# EAGLE design romscraj-printbed2 (EAGLE 5.10)
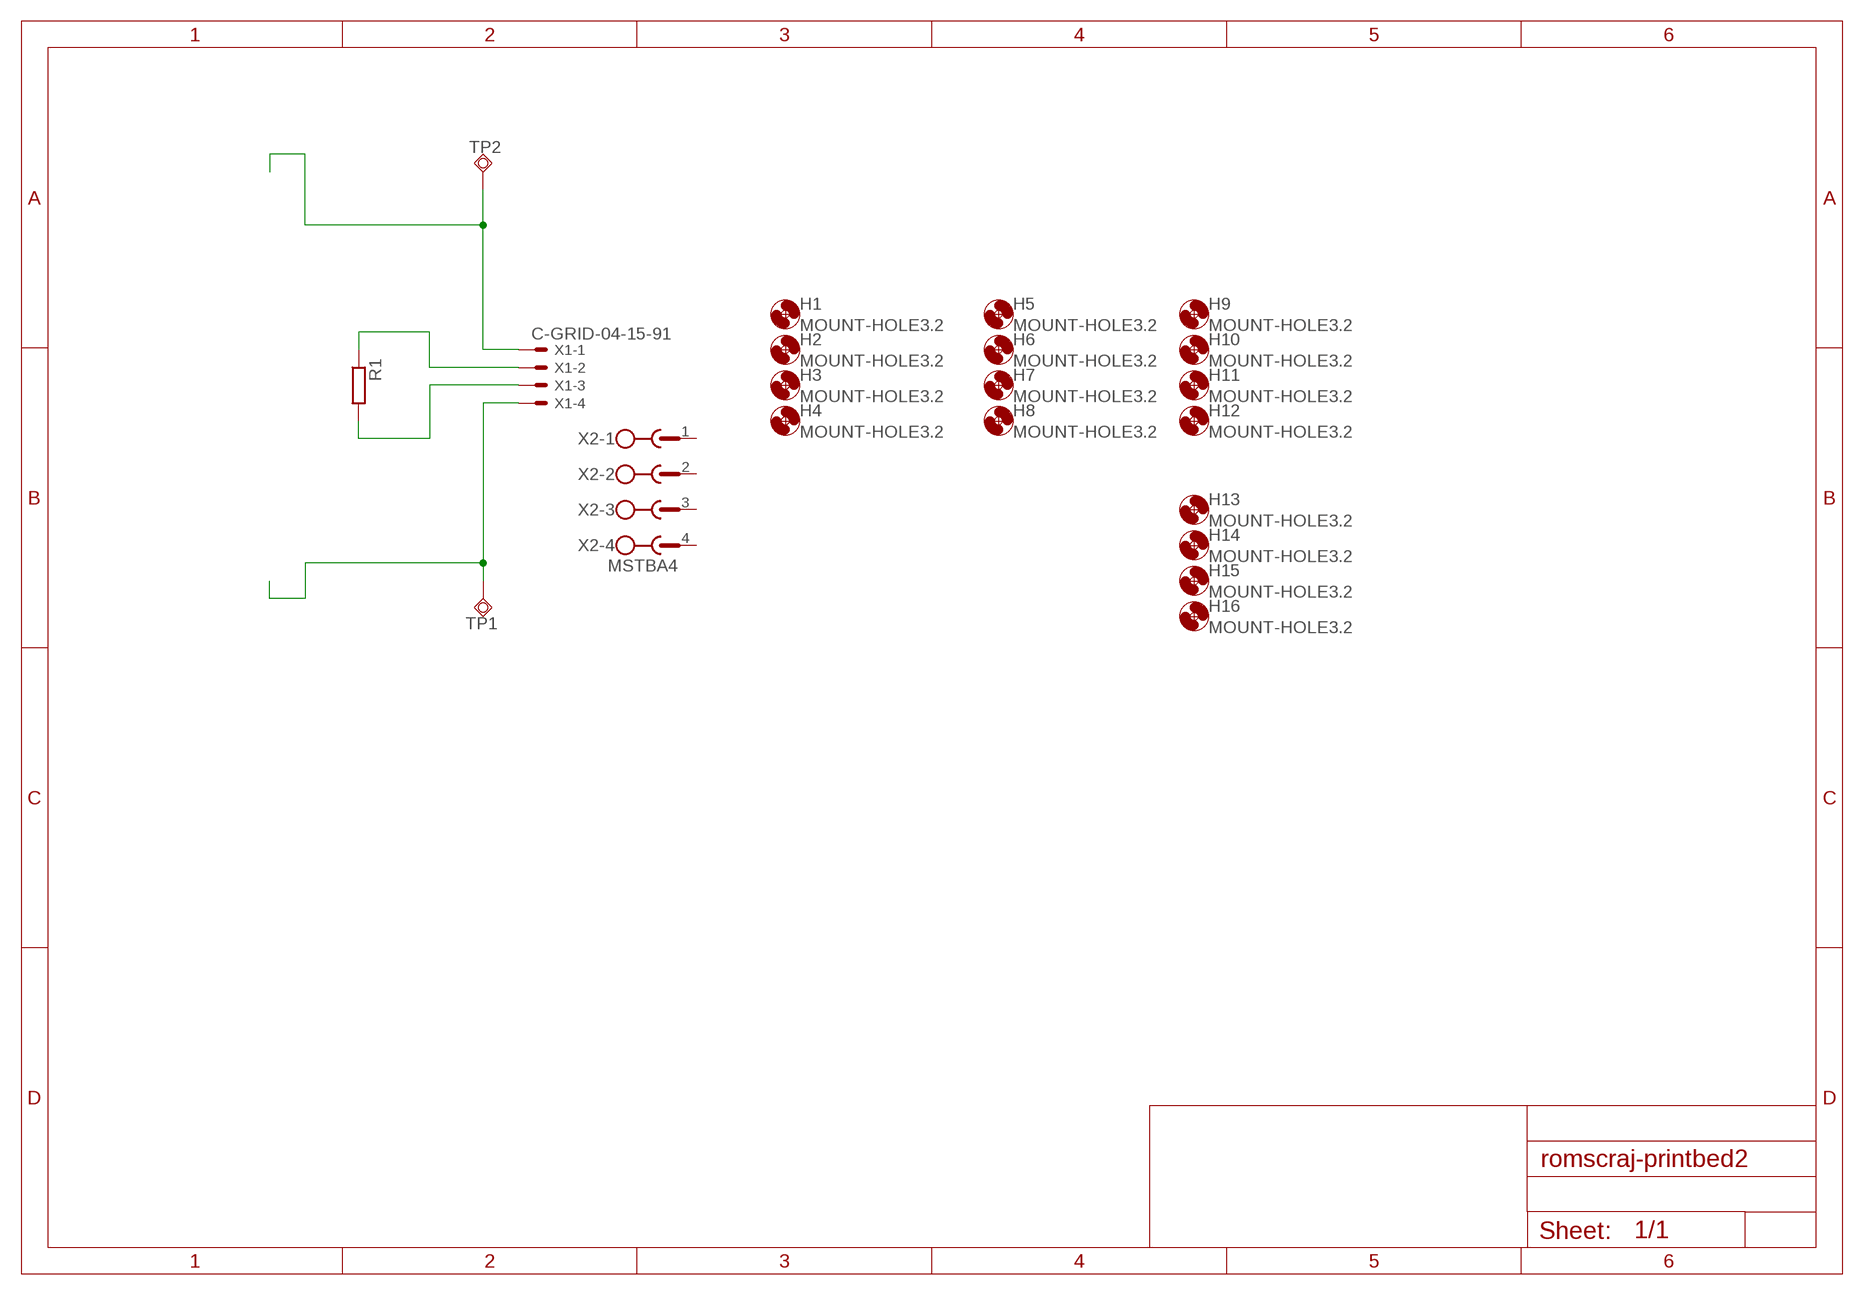
[diagram p0: schematic, sheet 1]

## Parts
H1  MOUNT-HOLE3.2  [3,2]
H2  MOUNT-HOLE3.2  [3,2]
H3  MOUNT-HOLE3.2  [3,2]
H4  MOUNT-HOLE3.2  [3,2]
H5  MOUNT-HOLE3.2  [3,2]
H6  MOUNT-HOLE3.2  [3,2]
H7  MOUNT-HOLE3.2  [3,2]
H8  MOUNT-HOLE3.2  [3,2]
H9  MOUNT-HOLE3.2  [3,2]
H10  MOUNT-HOLE3.2  [3,2]
H11  MOUNT-HOLE3.2  [3,2]
H12  MOUNT-HOLE3.2  [3,2]
H13  MOUNT-HOLE3.2  [3,2]
H14  MOUNT-HOLE3.2  [3,2]
H15  MOUNT-HOLE3.2  [3,2]
H16  MOUNT-HOLE3.2  [3,2]
R1  R-EU_R2010  [R2010]
TP1  TPSQTP20SQ  [TP20SQ]
TP2  TPSQTP20SQ  [TP20SQ]
X1  C-GRID-04-15-91  [15-91-04]
X2  MSTBA4  [MSTBA4]

## Nets
N$1: TP2.TP X1.1
N$2: TP1.TP X1.4
N$3: R1.1 X1.2
N$4: R1.2 X1.3
Unconnected: X2.1 X2.2 X2.3 X2.4

## Library data of the parts
H1-H16 = holes:MOUNT-HOLE: MOUNTING HOLE with drill center marker
R1 = rcl:R-EU_: RESISTOR, European symbol
TP1 TP2 = testpad:TPSQ: Test pad
X1 = con-molex:C-GRID-04: CONNECTOR wire to board 2.54 mm (0.100") pitch header
X2 = con-phoenix-508:MSTBA4: PHOENIX

## Board
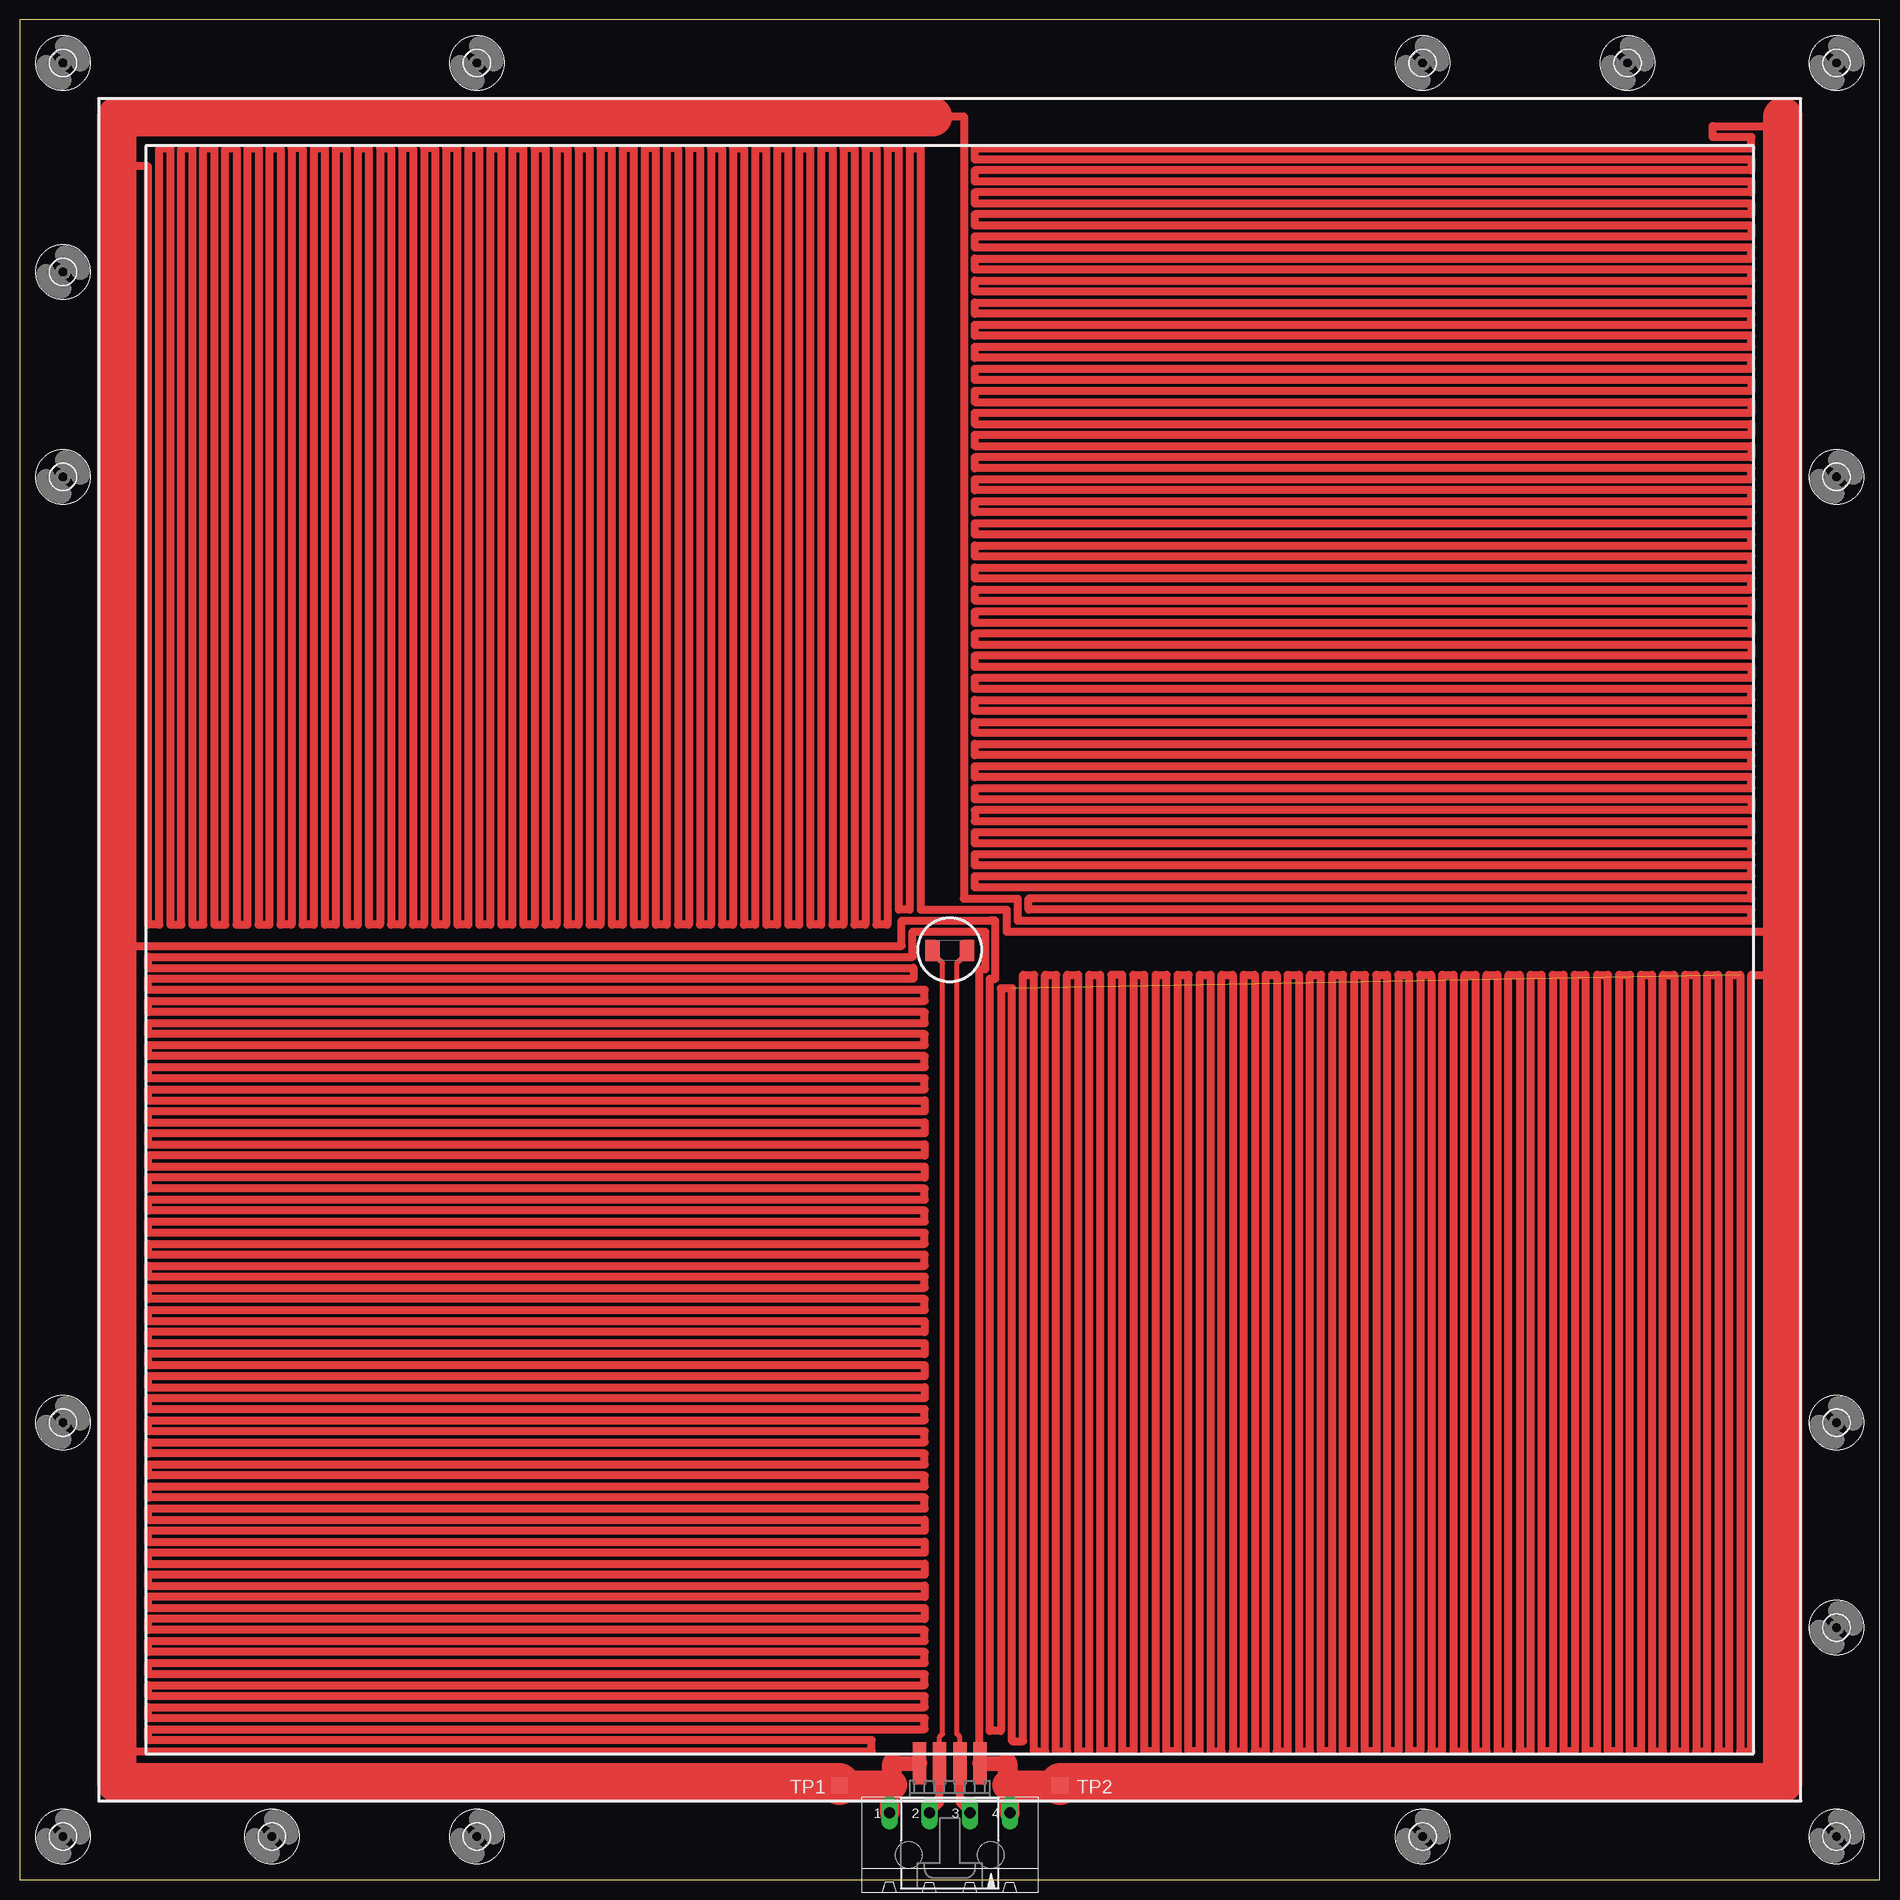
[diagram p1: board, top side]
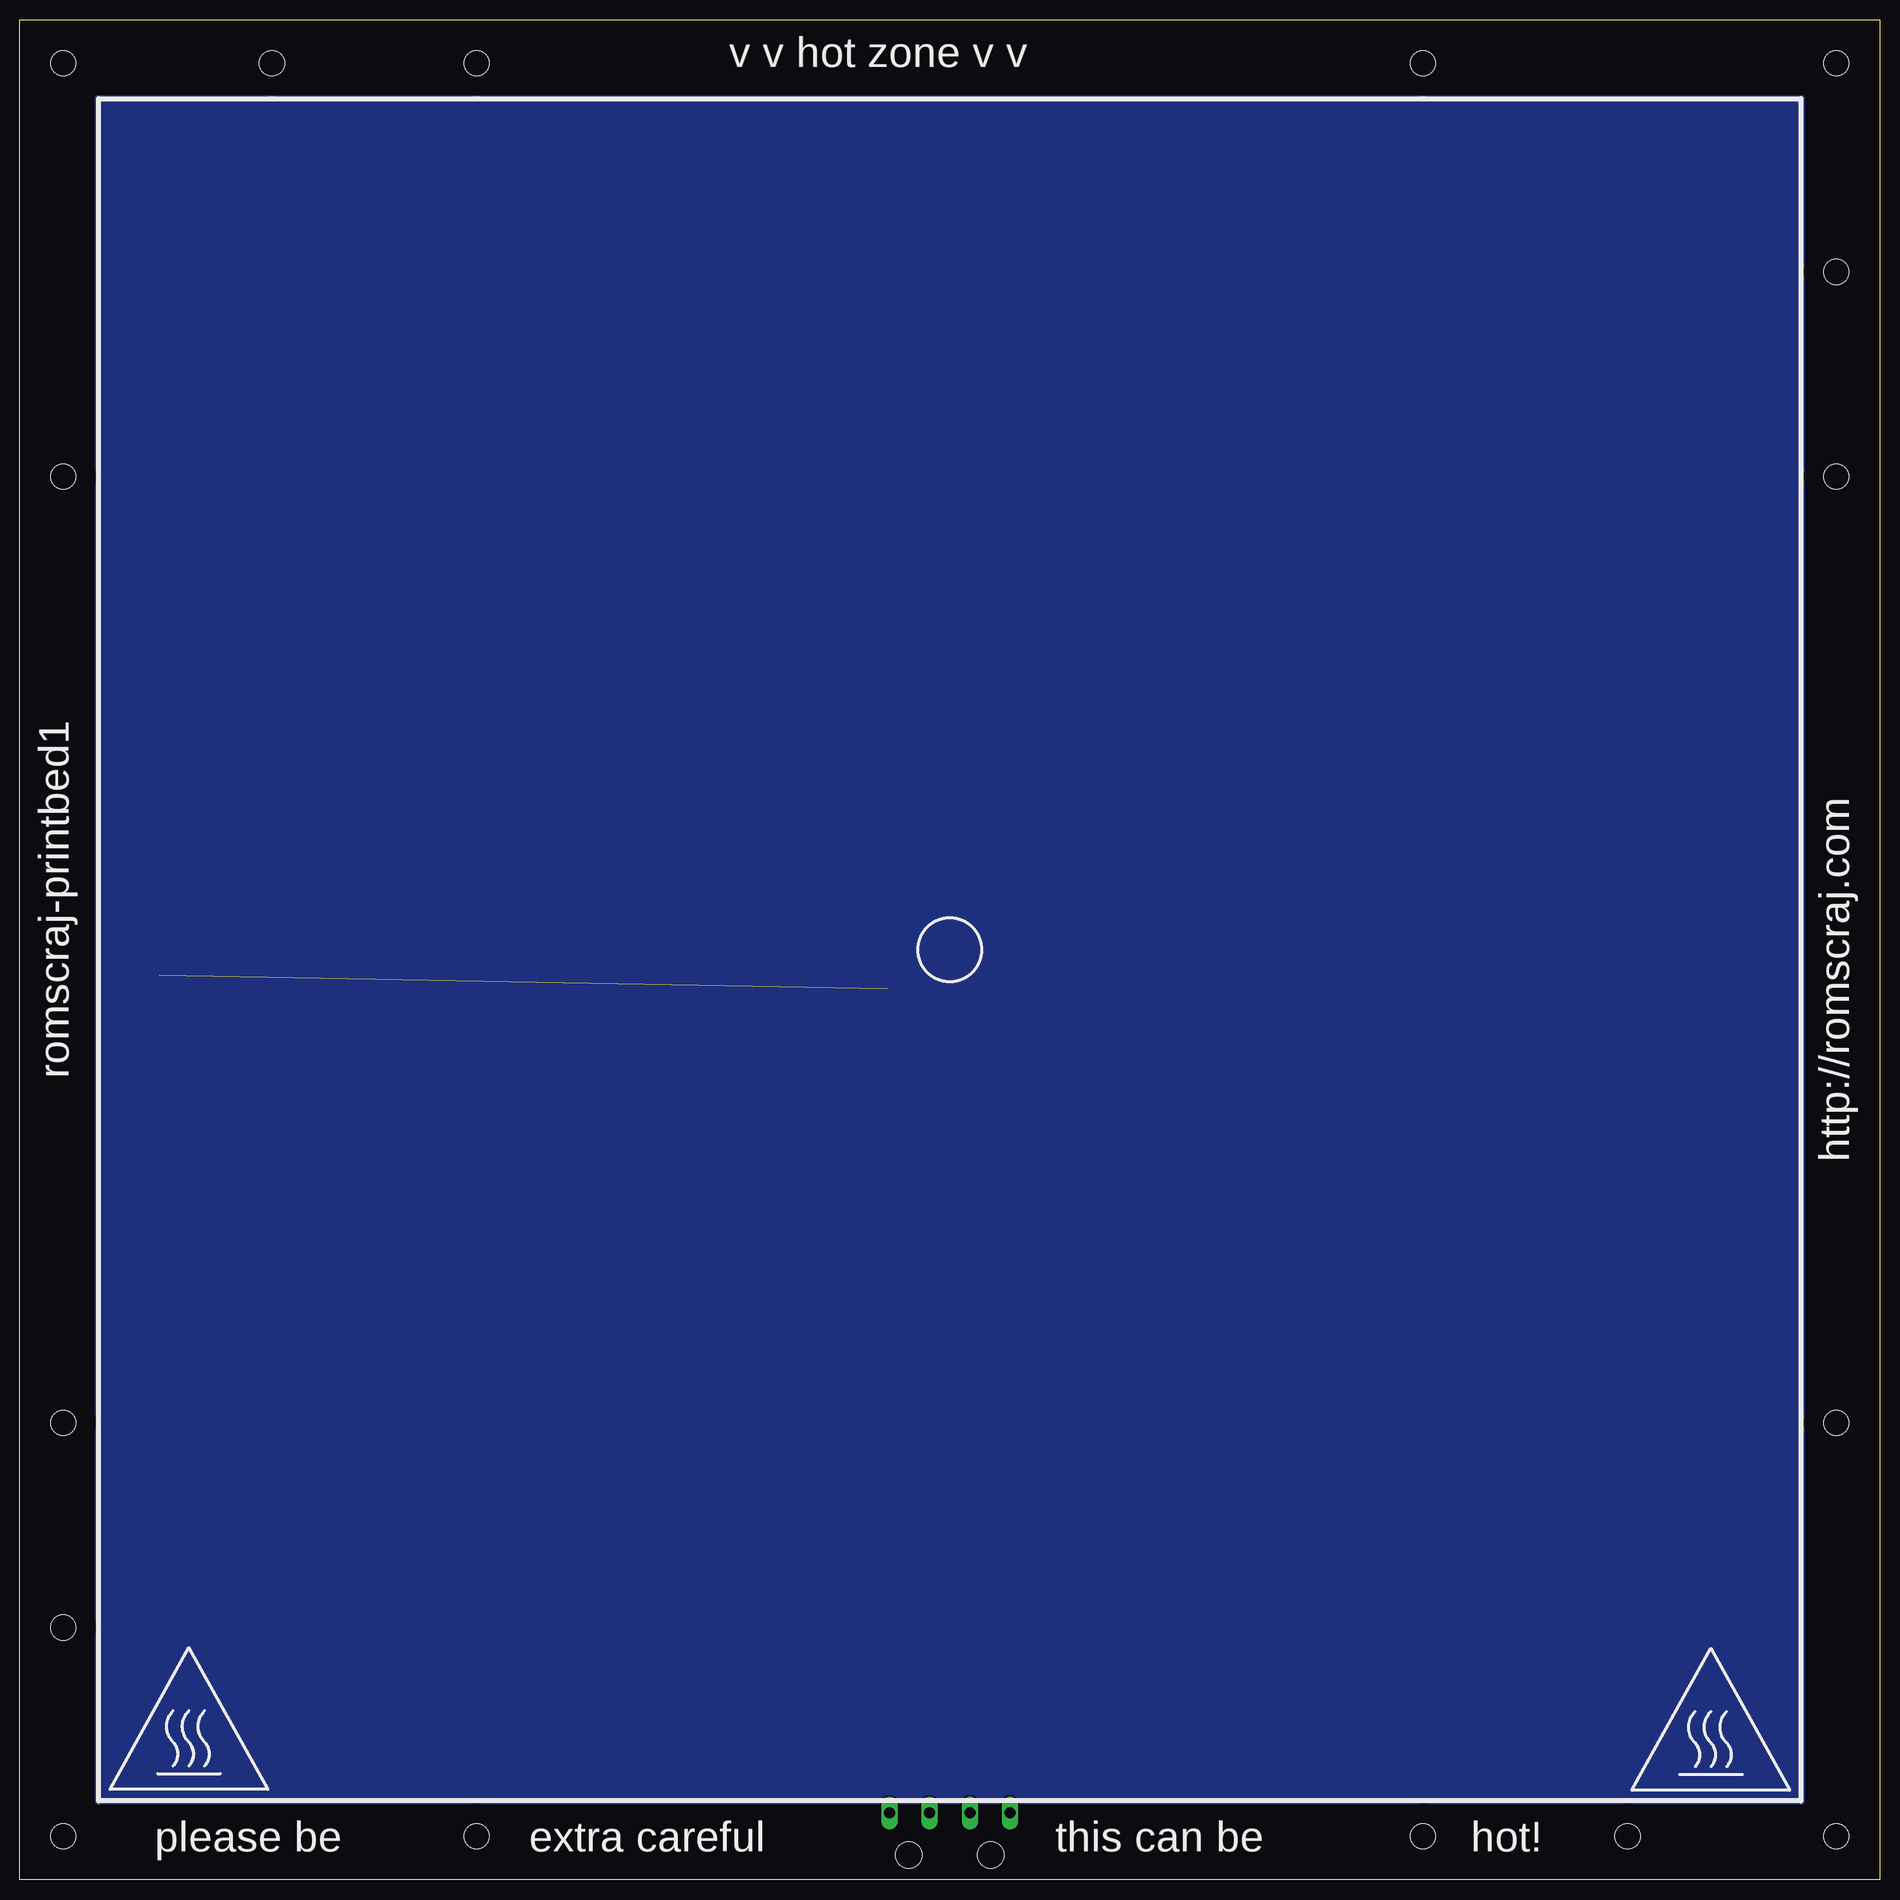
[diagram p2: board, bottom side, seen from below]

Size 236 x 236 mm. Coordinates in mm from the lower left corner, seen from the top.
Outline: 0,0 236,0 236,236 0,236 0,0
Copper layers (1*16): Top 0.035mm / dielectric 1.5mm / Bottom 0.035mm
Design rules "default *": minimum track width 10mil, minimum drill 24mil, track to track 8mil, track to pad 36mil, pad to pad 8mil, via to via 8mil, smd to smd 8mil, copper to edge 40mil, drill to drill 16mil, minimum pad ring 10mil, minimum via ring 8mil, stop-mask expansion 4mil, vias tented up to drill 0mil, thermal gap 10mil

### Footprints (pad centres in the part's own frame; a part is rotated, then mirrored left to right if it is on the bottom)
3,2 = hole 3.2: 0,0
R2010 = smd 1.8 x 2.7: 1 -2.2,0; 2 2.2,0
TP20SQ = smd 2 x 2: TP 0,0
15-91-04 = smd 1.651 x 5.334: 1 -3.81,-10.795; 2 -1.27,-10.795; 3 1.27,-10.795; 4 3.81,-10.795 | hole 3.404: -5.207,0.838; 5.207,0.838
MSTBA4 = drill 1.397 long: 1 -7.62,5.08; 2 -2.54,5.08; 3 2.54,5.08; 4 7.62,5.08

### Placement (x,y rotation side)
H1  5.5,5.5 0 top
H2  5.5,230.5 0 top
H3  230.5,230.5 0 top
H4  230.5,5.5 0 top
H5  5.5,58 0 top
H6  5.5,178 0 top
H7  230.5,178 0 top
H8  230.5,58 0 top
H9  58,230.5 0 top
H10  178,230.5 0 top
H11  178,5.5 0 top
H12  58,5.5 0 top
H13  32,5.5 0 top
H14  5.5,204 0 top
H15  204,230.5 0 top
H16  230.5,32 0 top
R1  118,117.9 180 top
TP1  104,12 0 top
TP2  132,12 0 top
X1  118,4 180 top
X2  118,3.4 0 top

### Tracks (layer width: path | path; a pad name or v marks a point on that pad's centre or on a via)
N$1
  Top 1.93: X1.1 125.3,14.79
  Top 2.54: 125.3,14.79 125.3,12
  Top 3.81: 125.3,12 TP2.TP
  Top 5: TP2.TP 132,12.3 223.7,12.3 223.7,223.7
N$2
  Top 1: 12.3,16.3 108.1,16.3 108.1,17.7 16.3,17.7 16.3,19.1 114.8,19.1 114.8,20.5 16.3,20.5 16.3,21.9
  Top 1.93: 110.7,14.79 X1.4
  Top 2.54: 110.7,12 110.7,14.79
  Top 3.81: TP1.TP 110.7,12
  Top 5: TP1.TP 104,12.3 12.3,12.3 12.3,16.3 12.3,223.7 115.8,223.7
N$3
  Top 0.61: R1.1 119.42,116.82 118.9,116.3 118.9,18.5 119.27,18.13 X1.2
N$4
  Top 0.61: R1.2 116.58,116.82 117.1,116.3 117.1,18.5 116.73,18.13 X1.3
N$5
  Top 1: 16.3,21.9 114.8,21.9 114.8,23.3 16.3,23.3 16.3,24.7
N$6
  Top 1: 16.3,24.7 114.8,24.7 114.8,26.1 16.3,26.1 16.3,27.5
N$7
  Top 1: 16.3,27.5 114.8,27.5 114.8,28.9 16.3,28.9 16.3,30.3
N$8
  Top 1: 16.3,30.3 114.8,30.3 114.8,31.7 16.3,31.7 16.3,33.1
N$9
  Top 1: 16.3,33.1 114.8,33.1 114.8,34.5 16.3,34.5 16.3,35.9
N$10
  Top 1: 16.3,35.9 114.8,35.9 114.8,37.3 16.3,37.3 16.3,38.7
N$11
  Top 1: 16.3,38.7 114.8,38.7 114.8,40.1 16.3,40.1 16.3,41.5
N$12
  Top 1: 16.3,41.5 114.8,41.5 114.8,42.9 16.3,42.9 16.3,44.3
N$13
  Top 1: 16.3,44.3 114.8,44.3 114.8,45.7 16.3,45.7 16.3,47.1
N$14
  Top 1: 16.3,47.1 114.8,47.1 114.8,48.5 16.3,48.5 16.3,49.9
N$15
  Top 1: 16.3,49.9 114.8,49.9 114.8,51.3 16.3,51.3 16.3,52.7
N$16
  Top 1: 16.3,52.7 114.8,52.7 114.8,54.1 16.3,54.1 16.3,55.5
N$17
  Top 1: 16.3,55.5 114.8,55.5 114.8,56.9 16.3,56.9 16.3,58.3
N$18
  Top 1: 16.3,58.3 114.8,58.3 114.8,59.7 16.3,59.7 16.3,61.1
N$19
  Top 1: 16.3,61.1 114.8,61.1 114.8,62.5 16.3,62.5 16.3,63.9
N$20
  Top 1: 16.3,63.9 114.8,63.9 114.8,65.3 16.3,65.3 16.3,66.7
N$21
  Top 1: 16.3,66.7 114.8,66.7 114.8,68.1 16.3,68.1 16.3,69.5
N$22
  Top 1: 16.3,69.5 114.8,69.5 114.8,70.9 16.3,70.9 16.3,72.3
N$23
  Top 1: 16.3,72.3 114.8,72.3 114.8,73.7 16.3,73.7 16.3,75.1
N$24
  Top 1: 16.3,75.1 114.8,75.1 114.8,76.5 16.3,76.5 16.3,77.9
N$25
  Top 1: 16.3,77.9 114.8,77.9 114.8,79.3 16.3,79.3 16.3,80.7
N$26
  Top 1: 16.3,80.7 114.8,80.7 114.8,82.1 16.3,82.1 16.3,83.5
N$27
  Top 1: 16.3,83.5 114.8,83.5 114.8,84.9 16.3,84.9 16.3,86.3
N$28
  Top 1: 16.3,86.3 114.8,86.3 114.8,87.7 16.3,87.7 16.3,89.1
N$29
  Top 1: 16.3,89.1 114.8,89.1 114.8,90.5 16.3,90.5 16.3,91.9
N$30
  Top 1: 16.3,91.9 114.8,91.9 114.8,93.3 16.3,93.3 16.3,94.7
N$31
  Top 1: 16.3,94.7 114.8,94.7 114.8,96.1 16.3,96.1 16.3,97.5
N$32
  Top 1: 16.3,97.5 114.8,97.5 114.8,98.9 16.3,98.9 16.3,100.3
N$33
  Top 1: 16.3,100.3 114.8,100.3 114.8,101.7 16.3,101.7 16.3,103.1
N$34
  Top 1: 16.3,103.1 114.8,103.1 114.8,104.5 16.3,104.5 16.3,105.9
N$35
  Top 1: 16.3,105.9 114.8,105.9 114.8,107.3 16.3,107.3 16.3,108.7
N$36
  Top 1: 111.5,123.1 112.9,123.1 112.9,219.7 114.3,219.7 114.3,123.1 125.2,123.1 125.2,120.3 223.7,120.3
N$37
  Top 1: 16.3,108.7 114.8,108.7 114.8,110.1 16.3,110.1 16.3,111.5
N$38
  Top 1: 16.3,111.5 114.8,111.5 114.8,112.9 16.3,112.9 16.3,114.3
N$39
  Top 1: 16.3,114.3 113.4,114.3 113.4,115.7 16.3,115.7 16.3,117.1
N$40
  Top 1: 16.3,117.1 113.3,117.1 113.3,120.3 122.5,120.3 122.5,115.5 121.7,115.5 121.7,16
N$41
  Top 1: 111.5,123.1 111.5,219.7 110.1,219.7 110.1,121.2 108.7,121.2
N$42
  Top 1: 108.7,121.2 108.7,219.7 107.3,219.7 107.3,121.2 105.9,121.2
N$43
  Top 1: 105.9,121.2 105.9,219.7 104.5,219.7 104.5,121.2 103.1,121.2
N$44
  Top 1: 103.1,121.2 103.1,219.7 101.7,219.7 101.7,121.2 100.3,121.2
N$45
  Top 1: 100.3,121.2 100.3,219.7 98.9,219.7 98.9,121.2 97.5,121.2
N$46
  Top 1: 97.5,121.2 97.5,219.7 96.1,219.7 96.1,121.2 94.7,121.2
N$47
  Top 1: 94.7,121.2 94.7,219.7 93.3,219.7 93.3,121.2 91.9,121.2
N$48
  Top 1: 91.9,121.2 91.9,219.7 90.5,219.7 90.5,121.2 89.1,121.2
N$49
  Top 1: 89.1,121.2 89.1,219.7 87.7,219.7 87.7,121.2 86.3,121.2
N$50
  Top 1: 86.3,121.2 86.3,219.7 84.9,219.7 84.9,121.2 83.5,121.2
N$51
  Top 1: 83.5,121.2 83.5,219.7 82.1,219.7 82.1,121.2 80.7,121.2
N$52
  Top 1: 80.7,121.2 80.7,219.7 79.3,219.7 79.3,121.2 77.9,121.2
N$53
  Top 1: 77.9,121.2 77.9,219.7 76.5,219.7 76.5,121.2 75.1,121.2
N$54
  Top 1: 75.1,121.2 75.1,219.7 73.7,219.7 73.7,121.2 72.3,121.2
N$55
  Top 1: 72.3,121.2 72.3,219.7 70.9,219.7 70.9,121.2 69.5,121.2
N$56
  Top 1: 69.5,121.2 69.5,219.7 68.1,219.7 68.1,121.2 66.7,121.2
N$57
  Top 1: 66.7,121.2 66.7,219.7 65.3,219.7 65.3,121.2 63.9,121.2
N$58
  Top 1: 63.9,121.2 63.9,219.7 62.5,219.7 62.5,121.2 61.1,121.2
N$59
  Top 1: 61.1,121.2 61.1,219.7 59.7,219.7 59.7,121.2 58.3,121.2
N$60
  Top 1: 58.3,121.2 58.3,219.7 56.9,219.7 56.9,121.2 55.5,121.2
N$61
  Top 1: 55.5,121.2 55.5,219.7 54.1,219.7 54.1,121.2 52.7,121.2
N$62
  Top 1: 52.7,121.2 52.7,219.7 51.3,219.7 51.3,121.2 49.9,121.2
N$63
  Top 1: 49.9,121.2 49.9,219.7 48.5,219.7 48.5,121.2 47.1,121.2
N$64
  Top 1: 47.1,121.2 47.1,219.7 45.7,219.7 45.7,121.2 44.3,121.2
N$65
  Top 1: 44.3,121.2 44.3,219.7 42.9,219.7 42.9,121.2 41.5,121.2
N$66
  Top 1: 41.5,121.2 41.5,219.7 40.1,219.7 40.1,121.2 38.7,121.2
N$67
  Top 1: 38.7,121.2 38.7,219.7 37.3,219.7 37.3,121.2 35.9,121.2
N$68
  Top 1: 35.9,121.2 35.9,219.7 34.5,219.7 34.5,121.2 33.1,121.2
N$69
  Top 1: 33.1,121.2 33.1,219.7 31.7,219.7 31.7,121.2 30.3,121.2
N$70
  Top 1: 30.3,121.2 30.3,219.7 28.9,219.7 28.9,121.2 27.5,121.2
N$71
  Top 1: 27.5,121.2 27.5,219.7 26.1,219.7 26.1,121.2 24.7,121.2
N$72
  Top 1: 24.7,121.2 24.7,219.7 23.3,219.7 23.3,121.2 21.9,121.2
N$73
  Top 1: 21.9,121.2 21.9,219.7 20.5,219.7 20.5,121.2 19.1,121.2
N$74
  Top 1: 19.1,121.2 19.1,219.7 17.7,219.7 17.7,121.2 16.3,121.2
N$75
  Top 1: 16.3,121.2 16.3,217.4 14,217.4
N$76  (1 unrouted)
  Top 1: 222.3,114.8 219.7,114.8 219.7,16.3 218.3,16.3 218.3,114.8 | 125.9,113.1 124.5,113.1 124.5,18.9 123.1,18.9 123.1,114.1
N$77
  Top 1: 125.9,113.1 125.9,17.6 127.3,17.6 127.3,114.8 128.7,114.8
N$78
  Top 1: 128.7,114.8 128.7,16.3 130.1,16.3 130.1,114.8 131.5,114.8
N$79
  Top 1: 131.5,114.8 131.5,16.3 132.9,16.3 132.9,114.8 134.3,114.8
N$80
  Top 1: 134.3,114.8 134.3,16.3 135.7,16.3 135.7,114.8 137.1,114.8
N$81
  Top 1: 137.1,114.8 137.1,16.3 138.5,16.3 138.5,114.8 139.9,114.8
N$82
  Top 1: 139.9,114.8 139.9,16.3 141.3,16.3 141.3,114.8 142.7,114.8
N$83
  Top 1: 142.7,114.8 142.7,16.3 144.1,16.3 144.1,114.8 145.5,114.8
N$84
  Top 1: 145.5,114.8 145.5,16.3 146.9,16.3 146.9,114.8 148.3,114.8
N$85
  Top 1: 148.3,114.8 148.3,16.3 149.7,16.3 149.7,114.8 151.1,114.8
N$86
  Top 1: 151.1,114.8 151.1,16.3 152.5,16.3 152.5,114.8 153.9,114.8
N$87
  Top 1: 153.9,114.8 153.9,16.3 155.3,16.3 155.3,114.8 156.7,114.8
N$88
  Top 1: 156.7,114.8 156.7,16.3 158.1,16.3 158.1,114.8 159.5,114.8
N$89
  Top 1: 159.5,114.8 159.5,16.3 160.9,16.3 160.9,114.8 162.3,114.8
N$90
  Top 1: 162.3,114.8 162.3,16.3 163.7,16.3 163.7,114.8 165.1,114.8
N$91
  Top 1: 165.1,114.8 165.1,16.3 166.5,16.3 166.5,114.8 167.9,114.8
N$92
  Top 1: 167.9,114.8 167.9,16.3 169.3,16.3 169.3,114.8 170.7,114.8
N$93
  Top 1: 170.7,114.8 170.7,16.3 172.1,16.3 172.1,114.8 173.5,114.8
N$94
  Top 1: 173.5,114.8 173.5,16.3 174.9,16.3 174.9,114.8 176.3,114.8
N$95
  Top 1: 176.3,114.8 176.3,16.3 177.7,16.3 177.7,114.8 179.1,114.8
N$96
  Top 1: 179.1,114.8 179.1,16.3 180.5,16.3 180.5,114.8 181.9,114.8
N$97
  Top 1: 181.9,114.8 181.9,16.3 183.3,16.3 183.3,114.8 184.7,114.8
N$98
  Top 1: 184.7,114.8 184.7,16.3 186.1,16.3 186.1,114.8 187.5,114.8
N$99
  Top 1: 187.5,114.8 187.5,16.3 188.9,16.3 188.9,114.8 190.3,114.8
N$100
  Top 1: 190.3,114.8 190.3,16.3 191.7,16.3 191.7,114.8 193.1,114.8
N$101
  Top 1: 193.1,114.8 193.1,16.3 194.5,16.3 194.5,114.8 195.9,114.8
N$102
  Top 1: 195.9,114.8 195.9,16.3 197.3,16.3 197.3,114.8 198.7,114.8
N$103
  Top 1: 198.7,114.8 198.7,16.3 200.1,16.3 200.1,114.8 201.5,114.8
N$104
  Top 1: 201.5,114.8 201.5,16.3 202.9,16.3 202.9,114.8 204.3,114.8
N$105
  Top 1: 204.3,114.8 204.3,16.3 205.7,16.3 205.7,114.8 207.1,114.8
N$106
  Top 1: 207.1,114.8 207.1,16.3 208.5,16.3 208.5,114.8 209.9,114.8
N$107
  Top 1: 209.9,114.8 209.9,16.3 211.3,16.3 211.3,114.8 212.7,114.8
N$108
  Top 1: 212.7,114.8 212.7,16.3 214.1,16.3 214.1,114.8 215.5,114.8
N$109
  Top 1: 215.5,114.8 215.5,16.3 216.9,16.3 216.9,114.8 218.3,114.8
N$110
  pour Bottom: 10,226 10,10 226,10 226,226
N$111
  Top 2.54: 110.4,8.6 110.4,11.6
N$112
  Top 1: 128,124.5 128,123.1 219.7,123.1 219.7,121.7 126.6,121.7 126.6,124.5 119.8,124.5 119.8,223.7 117.5,223.7
N$113
  Top 1: 128,124.5 219.7,124.5 219.7,125.9 121.2,125.9 121.2,127.3
N$114
  Top 1: 121.2,127.3 219.7,127.3 219.7,128.7 121.2,128.7 121.2,130.1
N$115
  Top 1: 121.2,130.1 219.7,130.1 219.7,131.5 121.2,131.5 121.2,132.9
N$116
  Top 1: 121.2,132.9 219.7,132.9 219.7,134.3 121.2,134.3 121.2,135.7
N$117
  Top 1: 121.2,135.7 219.7,135.7 219.7,137.1 121.2,137.1 121.2,138.5
N$118
  Top 1: 121.2,138.5 219.7,138.5 219.7,139.9 121.2,139.9 121.2,141.3
N$119
  Top 1: 121.2,141.3 219.7,141.3 219.7,142.7 121.2,142.7 121.2,144.1
N$120
  Top 1: 121.2,144.1 219.7,144.1 219.7,145.5 121.2,145.5 121.2,146.9
N$121
  Top 1: 121.2,146.9 219.7,146.9 219.7,148.3 121.2,148.3 121.2,149.7
N$122
  Top 1: 121.2,149.7 219.7,149.7 219.7,151.1 121.2,151.1 121.2,152.5
N$123
  Top 1: 121.2,152.5 219.7,152.5 219.7,153.9 121.2,153.9 121.2,155.3
N$124
  Top 1: 121.2,155.3 219.7,155.3 219.7,156.7 121.2,156.7 121.2,158.1
N$125
  Top 1: 121.2,158.1 219.7,158.1 219.7,159.5 121.2,159.5 121.2,160.9
N$126
  Top 1: 121.2,160.9 219.7,160.9 219.7,162.3 121.2,162.3 121.2,163.7
N$127
  Top 1: 121.2,163.7 219.7,163.7 219.7,165.1 121.2,165.1 121.2,166.5
N$128
  Top 1: 121.2,166.5 219.7,166.5 219.7,167.9 121.2,167.9 121.2,169.3
N$129
  Top 1: 121.2,169.3 219.7,169.3 219.7,170.7 121.2,170.7 121.2,172.1
N$130
  Top 1: 121.2,172.1 219.7,172.1 219.7,173.5 121.2,173.5 121.2,174.9
N$131
  Top 1: 121.2,174.9 219.7,174.9 219.7,176.3 121.2,176.3 121.2,177.7
N$132
  Top 1: 121.2,177.7 219.7,177.7 219.7,179.1 121.2,179.1 121.2,180.5
N$133
  Top 1: 121.2,180.5 219.7,180.5 219.7,181.9 121.2,181.9 121.2,183.3
N$134
  Top 1: 121.2,183.3 219.7,183.3 219.7,184.7 121.2,184.7 121.2,186.1
N$135
  Top 1: 121.2,186.1 219.7,186.1 219.7,187.5 121.2,187.5 121.2,188.9
N$136
  Top 1: 121.2,188.9 219.7,188.9 219.7,190.3 121.2,190.3 121.2,191.7
N$137
  Top 1: 121.2,191.7 219.7,191.7 219.7,193.1 121.2,193.1 121.2,194.5
N$138
  Top 1: 121.2,194.5 219.7,194.5 219.7,195.9 121.2,195.9 121.2,197.3
N$139
  Top 1: 121.2,197.3 219.7,197.3 219.7,198.7 121.2,198.7 121.2,200.1
N$140
  Top 1: 121.2,200.1 219.7,200.1 219.7,201.5 121.2,201.5 121.2,202.9
N$141
  Top 1: 121.2,202.9 219.7,202.9 219.7,204.3 121.2,204.3 121.2,205.7
N$142
  Top 1: 121.2,205.7 219.7,205.7 219.7,207.1 121.2,207.1 121.2,208.5
N$143
  Top 1: 121.2,208.5 219.7,208.5 219.7,209.9 121.2,209.9 121.2,211.3
N$144
  Top 1: 121.2,211.3 219.7,211.3 219.7,212.7 121.2,212.7 121.2,214.1
N$145
  Top 1: 121.2,214.1 219.7,214.1 219.7,215.5 121.2,215.5 121.2,216.9
N$146
  Top 1: 121.2,216.9 219.7,216.9 219.7,218.3 121.2,218.3 121.2,219.7
N$147
  Top 1: 121.2,219.7 219.7,219.7 219.7,221.1 214.8,221.1 214.8,222.5 222.2,222.5
N$148
  Top 2.54: 125.6,8.5 125.6,11.7
N$149
  Top 1: 115.5,8.5 116.7,9.7 116.7,13.7
N$150
  Top 1: 120.6,8.5 119.3,9.8 119.3,14.5
N$152
  Top 1: 123.1,114.3 123.8,114.3 123.8,121.7 123.1,121.7 122.9,121.7 111.9,121.7 111.9,118.5 13.4,118.5

### Text on the board
bNames: v v hot zone v v | romscraj-printbed1 | http://romscraj.com | hot! | this can be | extra careful | please be